# Altium schematic sheet BMS.SchDoc: BMS - AFE
size A4; DrawnBy: Jarod Krane; SheetNumber: 1; SheetTotal: 8
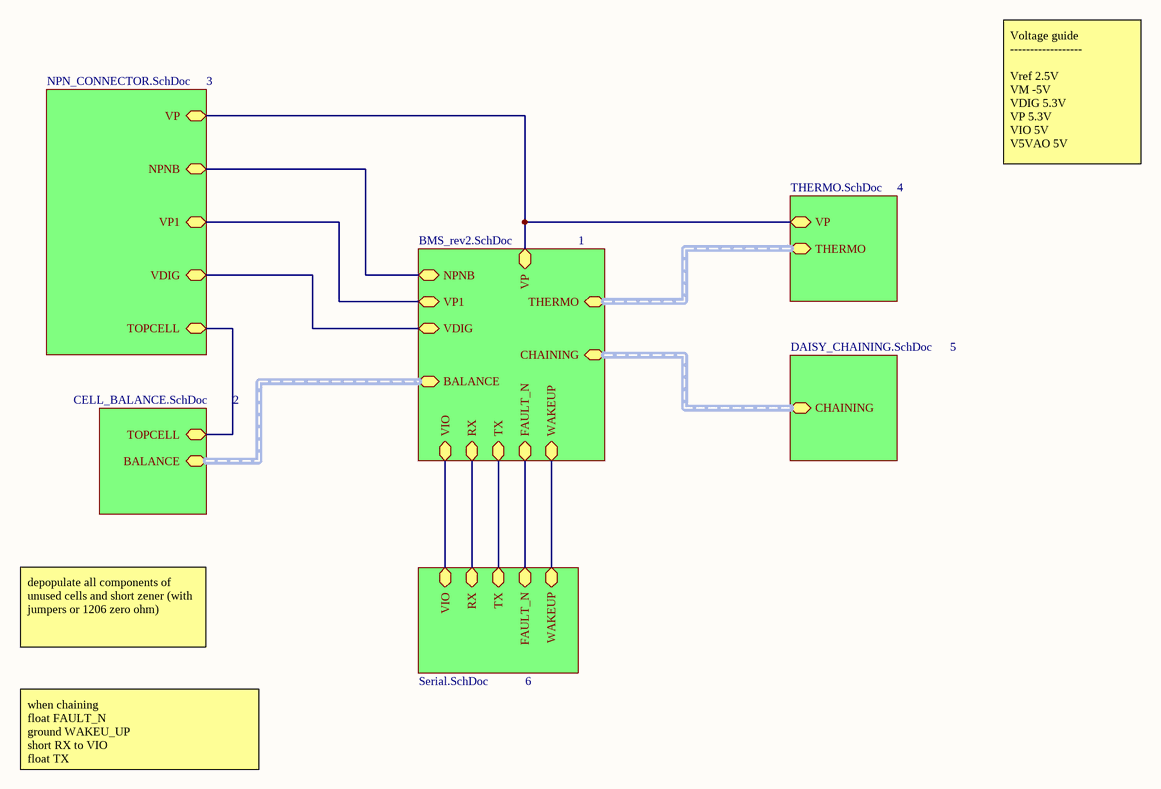
[diagram p0: BMS.SchDoc]

## Sub-sheets
1 = BMS_rev2.SchDoc: NPNB, VP, BALANCE (harness balance), THERMO, CHAINING, VDIG, VP1, VIO, RX, TX, FAULT_N, WAKEUP
2 = CELL_BALANCE.SchDoc: BALANCE, TOPCELL
3 = NPN_CONNECTOR.SchDoc: TOPCELL, NPNB, VP, VDIG, VP1
4 = THERMO.SchDoc: THERMO (harness thermo), VP
5 = DAISY_CHAINING.SchDoc: CHAINING (harness chaining)
6 = Serial.SchDoc: VIO, RX, TX, FAULT_N, WAKEUP

## Nets
(unnamed): sheet 1/NPNB, sheet 3/NPNB
(unnamed): sheet 1/VP, sheet 4/VP, sheet 3/VP
(unnamed): sheet 1/VDIG, sheet 3/VDIG
(unnamed): sheet 1/VP1, sheet 3/VP1
(unnamed): sheet 1/VIO, sheet 6/VIO
(unnamed): sheet 1/RX, sheet 6/RX
(unnamed): sheet 1/TX, sheet 6/TX
(unnamed): sheet 1/FAULT_N, sheet 6/FAULT_N
(unnamed): sheet 1/WAKEUP, sheet 6/WAKEUP
(unnamed): sheet 2/TOPCELL, sheet 3/TOPCELL

## Buses and harness runs
harness sheet 1/BALANCE = sheet 2/BALANCE
harness sheet 1/CHAINING = sheet 5/CHAINING
harness sheet 1/THERMO = sheet 4/THERMO

## Notes on the sheet
- Voltage guide
  ------------------
  Vref	2.5V
  VM	-5V
  VDIG	5.3V
  VP	5.3V
  VIO	5V
  V5VAO	5V
- depopulate all components of unused cells and short zener (with jumpers or 1206 zero ohm)
- when chaining
  float FAULT_N
  ground WAKEU_UP
  short RX to VIO
  float TX
  populate resistor connecting VIO to VP